# EAGLE design wristband (EAGLE 9.6.2)
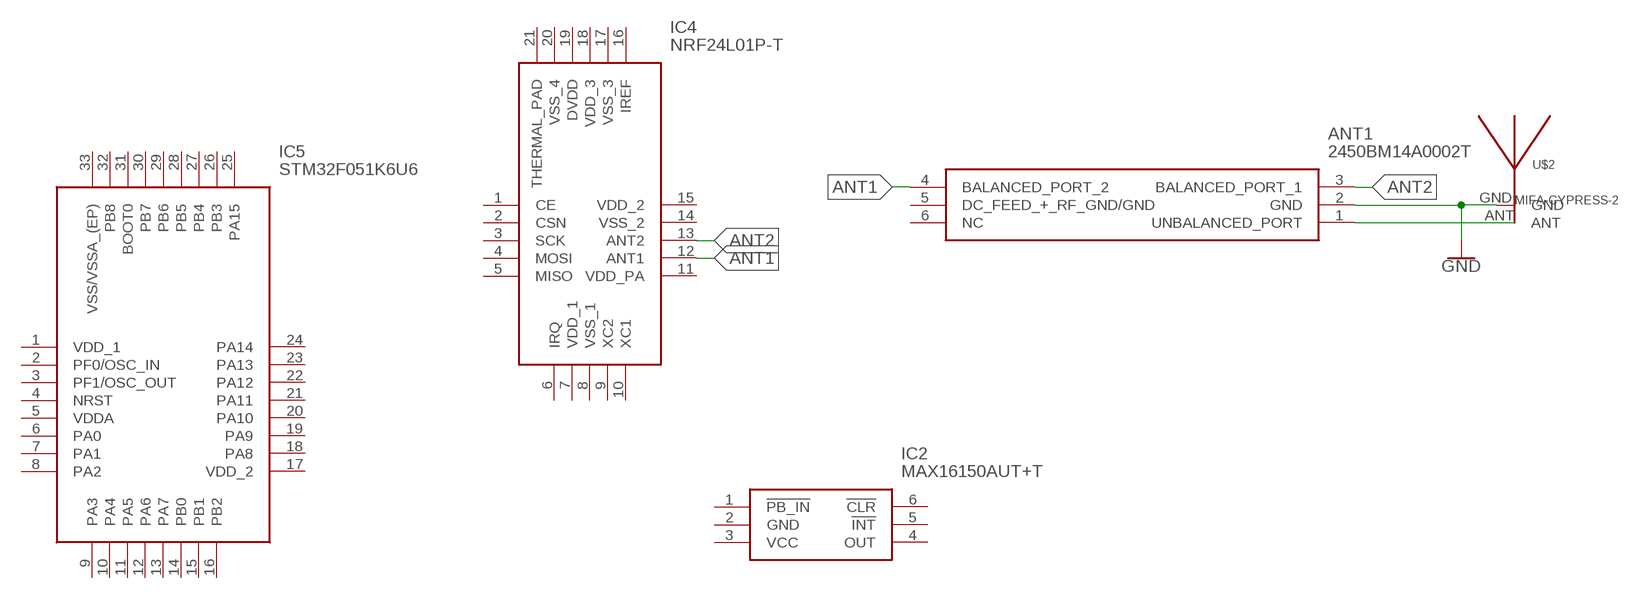
[diagram p0: schematic, sheet 1]

## Parts
ANT1  2450BM14A0002T  [2450BM14A0002T]
IC2  MAX16150AUT+T  [SOT95P280X145-6N]
IC4  NRF24L01P-T  [QFN50P400X400X95-21N]
IC5  STM32F051K6U6  [QFN50P500X500X60-33N]
U$2  MIFA-CYPRESS-2  [MIFA-CYPRESS-2]

## Nets
ANT1: ANT1.4(BALANCED_PORT_2) IC4.12(ANT1)
ANT2: ANT1.3(BALANCED_PORT_1) IC4.13(ANT2)
GND: ANT1.2(GND) U$2.GND
N$1: ANT1.1(UNBALANCED_PORT) U$2.ANT
Unconnected: ANT1.5(DC_FEED_+_RF_GND/GND) ANT1.6(NC) IC2.1(!PB_IN) IC2.2(GND) IC2.3(VCC) IC2.4(OUT) IC2.5(!INT) IC2.6(!CLR) IC4.1(CE) IC4.2(CSN) IC4.3(SCK) IC4.4(MOSI) IC4.5(MISO) IC4.6(IRQ) IC4.7(VDD_1) IC4.8(VSS_1) IC4.9(XC2) IC4.10(XC1) IC4.11(VDD_PA) IC4.14(VSS_2) IC4.15(VDD_2) IC4.16(IREF) IC4.17(VSS_3) IC4.18(VDD_3) IC4.19(DVDD) IC4.20(VSS_4) IC4.21(THERMAL_PAD) IC5.2(PF0/OSC_IN) IC5.3(PF1/OSC_OUT) IC5.4(NRST) IC5.6(PA0) IC5.7(PA1) IC5.8(PA2) IC5.9(PA3) IC5.10(PA4) IC5.11(PA5) IC5.12(PA6) IC5.13(PA7) IC5.14(PB0) IC5.15(PB1) IC5.16(PB2) IC5.18(PA8) IC5.19(PA9) IC5.20(PA10) IC5.21(PA11) IC5.22(PA12) IC5.23(PA13) IC5.24(PA14) IC5.25(PA15) IC5.26(PB3) IC5.27(PB4) IC5.28(PB5) IC5.29(PB6) IC5.30(PB7) IC5.31(BOOT0) IC5.32(PB8)

## Power pins joined to a net without a drawn wire
VDD_1: IC5.1(VDD_1)
VDD_2: IC5.17(VDD_2)
VDDA: IC5.5(VDDA)
VSS/VSSA_(EP): IC5.33(VSS/VSSA_(EP))

## Library data of the parts
ANT1 = 2450BM14A0002T:2450BM14A0002T: JOHANSON TECHNOLOGY - 2450BM14A0002T - BALUN, 2.45GHZ, IMPEDANCE MATCHED Source: Datasheet; DESCRIPTION: JOHANSON TECHNOLOGY - 2450BM14A0002T - BALUN, 2.45GHZ, IMPEDANCE MATCHED; HEIGHT: 0.7mm; MANUFACTURER_NAME: JOHANSON TECHNOLOGY; MANUFACTURER_PART_NUMBER: 2450BM14A0002T; MOUSER_PART_NUMBER: 609-2450BM14A0002T; MOUSER_PRICE-STOCK: https://www.mouser.co.uk/ProductDetail/Johanson-Technology/2450BM14A0002T?qs=yCnrNFeXz%252Bjc2NrpGmrycg%3D%3D
IC2 = MAX16150AUT+T:MAX16150AUT+T: Supervisory Circuits Nano-Power Pushbutton ON/OFF Controller with 15kV ESD Protection and Programmable Timer Source: Datasheet; DESCRIPTION: Supervisory Circuits Nano-Power Pushbutton ON/OFF Controller with 15kV ESD Protection and Programmable Timer; HEIGHT: 1.45mm; MANUFACTURER_NAME: Maxim Integrated; MANUFACTURER_PART_NUMBER: MAX16150AUT+T; MOUSER_PART_NUMBER: 700-MAX16150AUT+T; MOUSER_PRICE-STOCK: https://www.mouser.co.uk/ProductDetail/Maxim-Integrated/MAX16150AUT%2bT?qs=wnTfsH77Xs5xR8unQygqcw%3D%3D
IC4 = nRF24L01P-T:NRF24L01P-T: RF Transceiver IC 2.4GHz ISM Band QFN20 Nordic Semiconductor NRF24L01P-T, RF Transceiver 2400MHz to 2483.5MHz 1.9 3.6 V 20-Pin QFN Source: Datasheet <http://www.nordicsemi.com/eng/content/download/2726/34069/file/nRF24L01P_Product_Specification_1_0.pdf>; DESCRIPTION: RF Transceiver IC 2.4GHz ISM Band QFN20 Nordic Semiconductor NRF24L01P-T, RF Transceiver 2400MHz to 2483.5MHz 1.9 3.6 V 20-Pin QFN; HEIGHT: 0.95mm; MANUFACTURER_NAME: Nordic Semiconductor; MANUFACTURER_PART_NUMBER: nRF24L01P-T; MOUSER_PART_NUMBER: 949-NRF24L01P-T; MOUSER_PRICE-STOCK: https://www.mouser.co.uk/ProductDetail/Nordic-Semiconductor/nRF24L01P-T?qs=yd0qOhnSiDf9ybbDsku6vg%3D%3D
IC5 = STM32F051K6U6:STM32F051K6U6: Source: Datasheet <http://www.st.com/web/en/resource/technical/document/datasheet/DM00039193.pdf>; HEIGHT: 0.6mm; MANUFACTURER_NAME: STMicroelectronics; MANUFACTURER_PART_NUMBER: STM32F051K6U6; MOUSER_PART_NUMBER: 511-STM32F051K6U6; MOUSER_PRICE-STOCK: https://www.mouser.co.uk/ProductDetail/STMicroelectronics/STM32F051K6U6?qs=hFZnydTV6MdSevkmdmPAaA%3D%3D
U$2 = MIFA:MIFA-CYPRESS

## Board
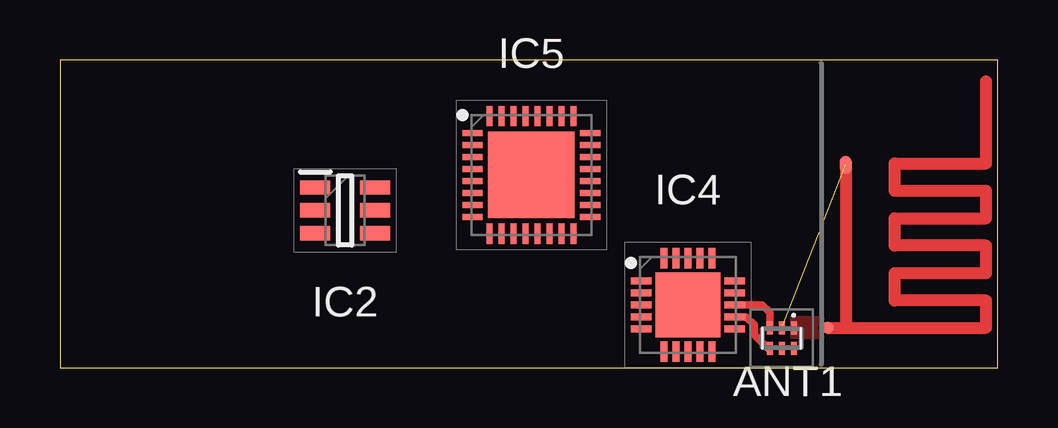
[diagram p1: board, top side]

Size 39.1 x 12.85 mm. Coordinates in mm from the lower left corner, seen from the top.
Outline: 0,0 39.1,0 39.1,12.85 0,12.85 0,0
Copper layers (1*16): Top 0.035559375mm / dielectric 1.6mm / Bottom 0.035559375mm
Design rules "jlcpcb2layer": minimum track width 5mil, minimum drill 12mil, track to track 5mil, track to pad 5mil, pad to pad 5mil, via to via 5mil, smd to smd 5mil, copper to edge 8mil, drill to drill 6mil, minimum pad ring 5mil, minimum via ring 3mil, stop-mask expansion 2.5mil, vias tented up to drill 0mil, thermal gap 10mil

### Footprints (pad centres in the part's own frame; a part is rotated, then mirrored left to right if it is on the bottom)
2450BM14A0002T = smd 0.25 x 0.55: 1 0.5,0.425; 2 0,0.425; 3 -0.5,0.425; 4 -0.5,-0.425; 5 0,-0.425; 6 0.5,-0.425
SOT95P280X145-6N = smd 1.25 x 0.6: 1 -1.25,0.95; 2 -1.25,0; 3 -1.25,-0.95; 4 1.25,-0.95; 5 1.25,0; 6 1.25,0.95
QFN50P400X400X95-21N = smd 0.85 x 0.3: 1 -1.95,1; 2 -1.95,0.5; 3 -1.95,0; 4 -1.95,-0.5; 5 -1.95,-1; 11 1.95,-1; 12 1.95,-0.5; 13 1.95,0; 14 1.95,0.5; 15 1.95,1 | smd 0.3 x 0.85: 6 -1,-1.95; 7 -0.5,-1.95; 8 0,-1.95; 9 0.5,-1.95; 10 1,-1.95; 16 1,1.95; 17 0.5,1.95; 18 0,1.95; 19 -0.5,1.95; 20 -1,1.95 | smd 2.7 x 2.7: 21 0,0
QFN50P500X500X60-33N = smd 0.85 x 0.25: 1 -2.45,1.75; 2 -2.45,1.25; 3 -2.45,0.75; 4 -2.45,0.25; 5 -2.45,-0.25; 6 -2.45,-0.75; 7 -2.45,-1.25; 8 -2.45,-1.75; 17 2.45,-1.75; 18 2.45,-1.25; 19 2.45,-0.75; 20 2.45,-0.25; 21 2.45,0.25; 22 2.45,0.75; 23 2.45,1.25; 24 2.45,1.75 | smd 0.25 x 0.85: 9 -1.75,-2.45; 10 -1.25,-2.45; 11 -0.75,-2.45; 12 -0.25,-2.45; 13 0.25,-2.45; 14 0.75,-2.45; 15 1.25,-2.45; 16 1.75,-2.45; 25 1.75,2.45; 26 1.25,2.45; 27 0.75,2.45; 28 0.25,2.45; 29 -0.25,2.45; 30 -0.75,2.45; 31 -1.25,2.45; 32 -1.75,2.45 | smd 3.6 x 3.6: 33 0,0
MIFA-CYPRESS-2 = smd 0.508 x 0.508: ANT 0.254,0 | smd 0.508 x 0.762: GND 1.016,6.807

### Placement (x,y rotation side)
ANT1  30.09,1.25 0 top
IC2  11.89,6.58 0 top
IC4  26.17,2.64 0 top
IC5  19.65,8.06 0 top
U$2  31.74,1.68 0 top

### Tracks (layer width: path | path; a pad name or v marks a point on that pad's centre or on a via)
ANT1
  Top 0.305: IC4.12 28.6,2.14 28.94,1.79 28.94,1.38 29.5,0.83 ANT1.4
ANT2
  Top 0.305: IC4.13 29.27,2.64 29.59,2.32 ANT1.3
GND  (1 unrouted)
N$1
  pour Top (no thermals): 32,1.91 31.78,2.13 30.45,2.13 30.45,1.24 31.8,1.24 32,1.45